# EAGLE schematic Tile (EAGLE 7.5.0)
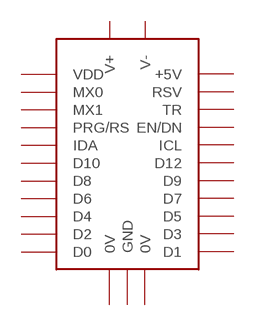
[diagram p0: schematic, sheet 1]

## Parts
T1  UTILE_LPTILE  [UTILE_LP_T]
Unconnected: T1.0V@1(0V) T1.0V@2(0V) T1.P$1(V-) T1.P$2(V-) T1.P$3(V-) T1.P$4(V-) T1.P$5(V-) T1.P$6(V-) T1.P$7(GND) T1.P$8(D0) T1.P$9(D2) T1.P$10(D4) T1.P$11(D6) T1.P$12(D8) T1.P$13(D10) T1.P$14(IDA) T1.P$15(PRG/RS) T1.P$16(MX1) T1.P$17(MX0) T1.P$18(VDD) T1.P$20(V+) T1.P$21(V+) T1.P$22(V+) T1.P$23(V+) T1.P$24(V+) T1.P$25(V+) T1.P$26(V-) T1.P$27(V-) T1.P$28(V-) T1.P$29(V-) T1.P$30(V-) T1.P$31(V-) T1.P$32(GND) T1.P$33(D1) T1.P$34(D3) T1.P$35(D5) T1.P$36(D7) T1.P$37(D9) T1.P$38(D12) T1.P$39(ICL) T1.P$40(EN/DN) T1.P$41(TR) T1.P$42(RSV) T1.P$43(+5V) T1.P$45(V+) T1.P$46(V+) T1.P$47(V+) T1.P$48(V+) T1.P$49(V+) T1.P$50(V+)

## Library data of the parts
T1 = amino:UTILE_LP